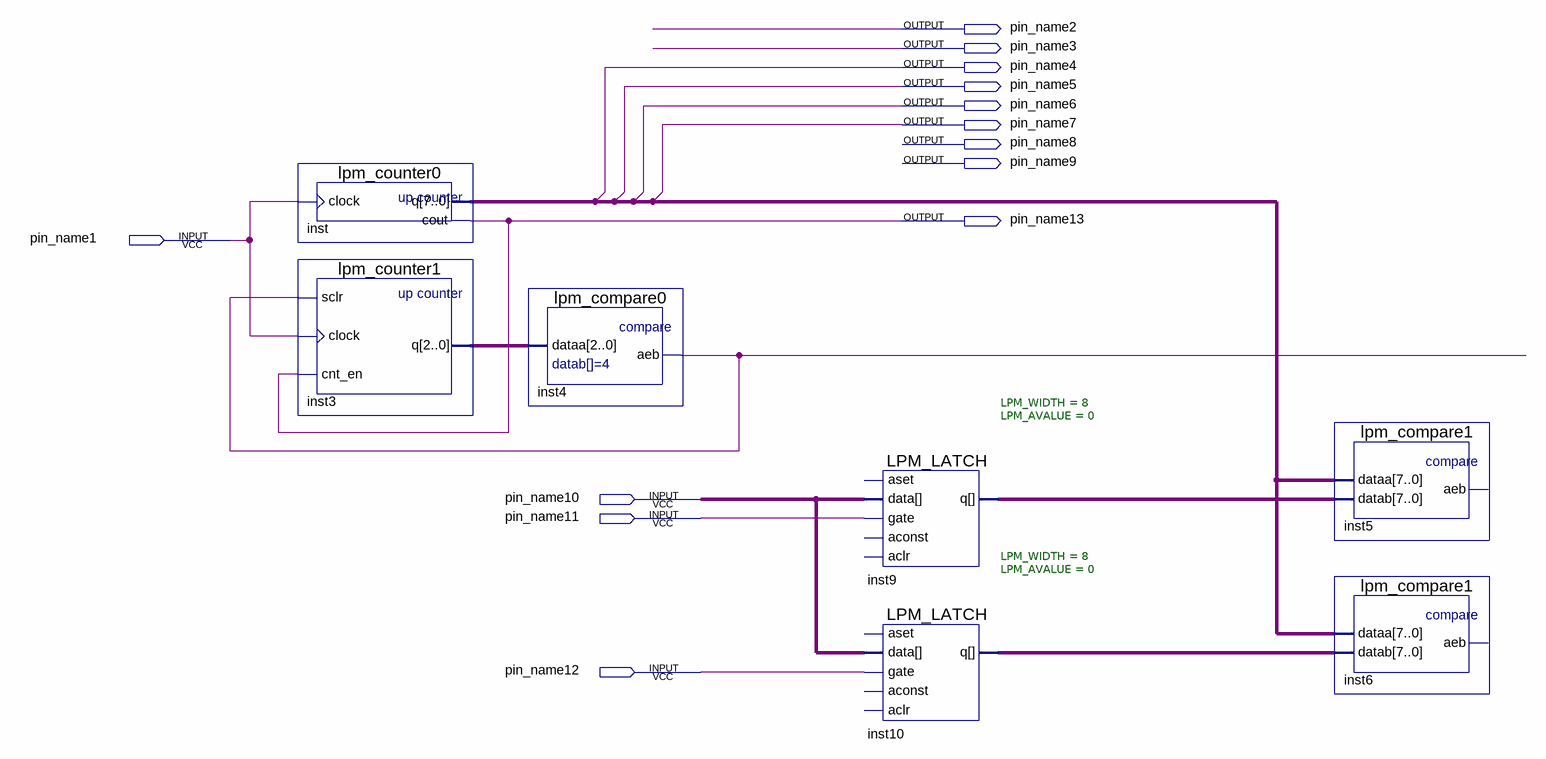
[diagram p0: schematic sheet]
// Quartus schematic curvetracer.bdf as structural Verilog: 7 symbols, 13 pins
module curvetracer (
  input  pin_name1,
  input  pin_name10,
  input  pin_name11,
  input  pin_name12,
  output pin_name2,
  output pin_name3,
  output pin_name4,
  output pin_name5,
  output pin_name6,
  output pin_name7,
  output pin_name8,
  output pin_name9,
  output pin_name13
);

  wire inst4_aeb;
  wire [2:0] inst3_q;
  wire [7:0] inst9_q, inst10_q, inst_q, undriven;

  lpm_counter0 inst (.clock(pin_name1), .cout(pin_name13), .q(inst_q));
  lpm_counter1 inst3 (.sclr(inst4_aeb), .clock(pin_name1), .cnt_en(pin_name13), .q(inst3_q));
  lpm_compare0 inst4 (.dataa(inst3_q), .aeb(inst4_aeb));
  LPM_LATCH #(.LPM_WIDTH(8), .LPM_AVALUE(0)) inst9 (
    .data(undriven), .gate(pin_name11), .q(inst9_q));  // open: aset, aconst, aclr
  LPM_LATCH #(.LPM_WIDTH(8), .LPM_AVALUE(0)) inst10 (
    .data(undriven), .gate(pin_name12), .q(inst10_q));  // open: aset, aconst, aclr
  lpm_compare1 inst5 (.dataa(inst_q), .datab(inst9_q));  // open: aeb
  lpm_compare1 inst6 (.dataa(inst_q), .datab(inst10_q));  // open: aeb
endmodule
